# EAGLE design TriggerMount (EAGLE 9.6.2)
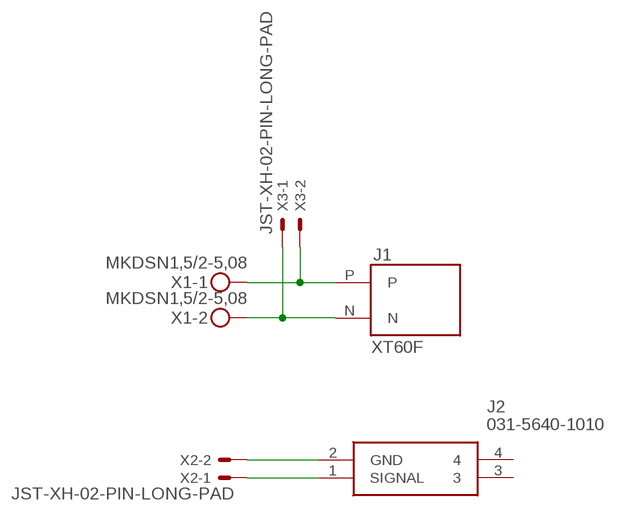
[diagram p0: schematic, sheet 1]

## Parts
J1  XT60F  [XT60PW]
J2  031-5640-1010  [03156401010]
X1  MKDSN1,5/2-5,08  [MKDSN1,5/2-5,08]
X2  JST-XH-02-PIN-LONG-PAD  [JST-XH-02-PACKAGE-LONG-PAD]
X3  JST-XH-02-PIN-LONG-PAD  [JST-XH-02-PACKAGE-LONG-PAD]

## Nets
N$1: J1.N X1.2 X3.1
N$2: J1.P X1.1 X3.2
N$3: J2.2(GND) X2.2
N$4: J2.1(SIGNAL) X2.1
Unconnected: J2.3 J2.4

## Library data of the parts
J1 = VDS-Connectors:XT60
J2 = SamacSys_Parts:031-5640-1010: RF Connectors / Coaxial Connectors PC BH RECEPT Source: Datasheet <https://www.amphenolrf.com/downloads/dl/file/id/3144/product/593/031_5640_1010_customer_drawing.pdf>; ALLIED_NUMBER: 70141899; ALLIED_PRICE-STOCK: https://www.alliedelec.com/amphenolrf-031-5640-1010/70141899/; DESCRIPTION: RF Connectors / Coaxial Connectors PC BH RECEPT; HEIGHT: 15.9mm; MANUFACTURER_NAME: Amphenol; MANUFACTURER_PART_NUMBER: 031-5640-1010; MOUSER_PART_NUMBER: 523-31-5640-1010; MOUSER_PRICE-STOCK: https://www.mouser.co.uk/ProductDetail/Amphenol-RF/031-5640-1010?qs=py4qCovljJ8AWoJP%2FInlhw%3D%3D
X1 = con-phoenix-508:MKDSN1,5/2-5,08: MKDSN 1,5/ 2-5,08 Printklemme Nennstrom: 13,5 A Nennspannung: 250 V Rastermaß: 5,08 mm Polzahl: 2 Anschlussart: Schraubanschluss Montage: Löten Anschlussrichtung Leiter/Platine: 0 ° Artikelnummer: 1729128 Source: http://eshop.phoenixcontact.com .. 1729128.pdf
X2 X3 = Rembrandt Electronics - JST XH Connectors v1-0:JST-XH-02-PIN: JST XH Connector 2 Pin Wire to board connector. Pitch: 2,54 mm, (0.100") Number of pins: 2 Created by Rembrandt Electronics www.rembrandtelectronics.com

## Board
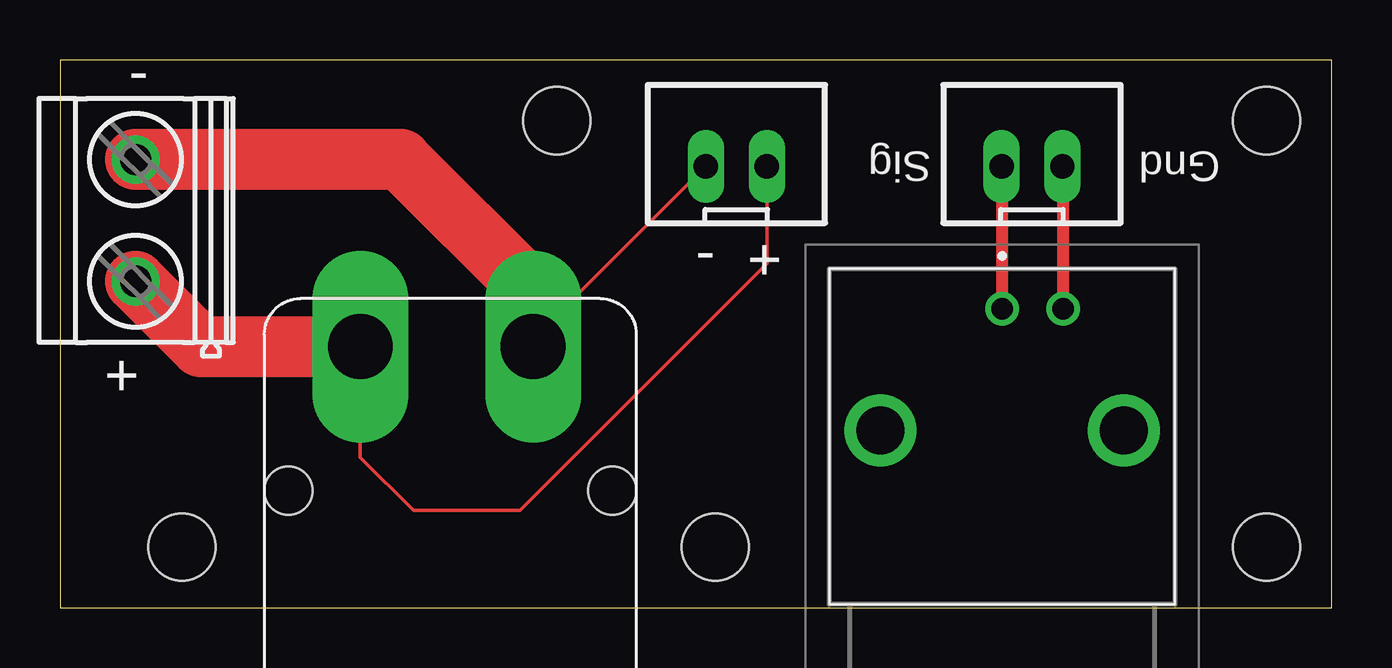
[diagram p1: board, top side]
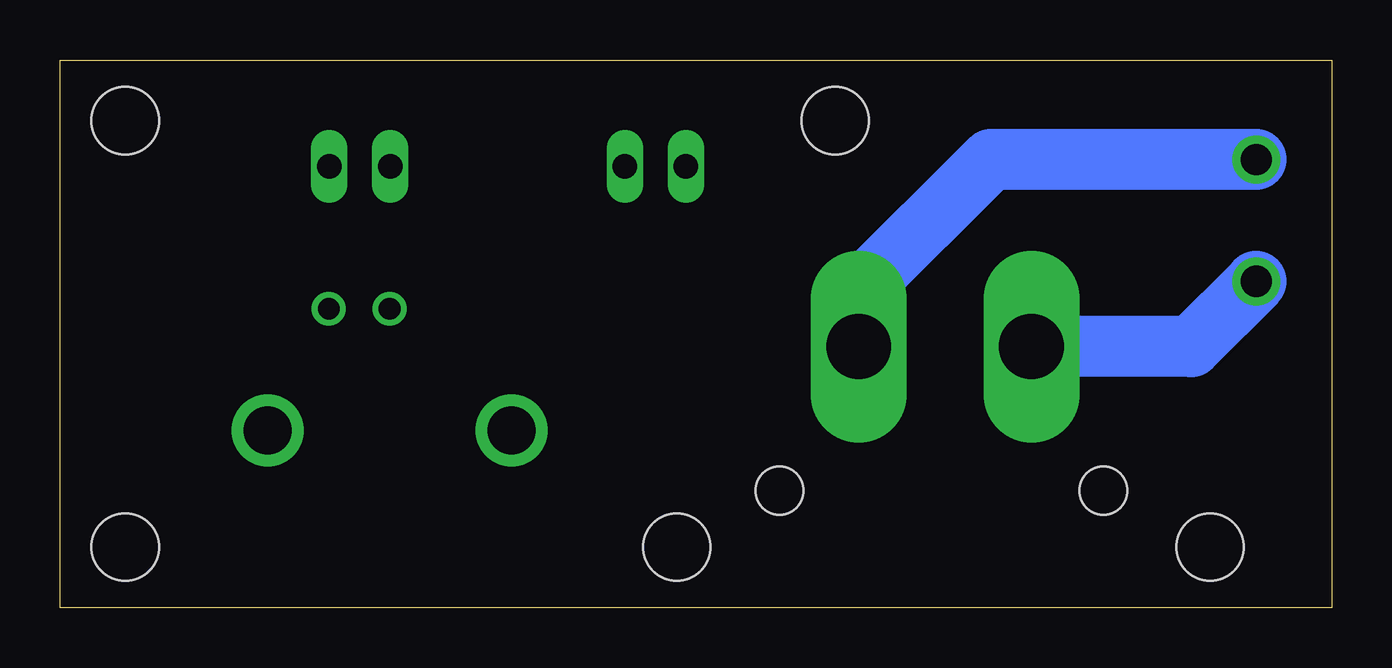
[diagram p2: board, bottom side, seen from below]

Size 53.01 x 22.85 mm. Coordinates in mm from the lower left corner, seen from the top.
Outline: 0,0 53.01,0 53.01,22.85 0,22.85 0,0
Copper layers (1*16): Top 0.035mm / dielectric 1.5mm / Bottom 0.035mm
Design rules "default": minimum track width 6mil, minimum drill 0.35mm, track to track 6mil, track to pad 6mil, pad to pad 6mil, via to via 6mil, smd to smd 6mil, copper to edge 40mil, drill to drill 6mil, minimum pad ring 10mil, minimum via ring 8mil, stop-mask expansion 4mil, vias tented up to drill 0mil, thermal gap 10mil
Holes 2.8 mm at 5.08,2.54 50.29,20.32 50.29,2.54 27.3,2.54 20.7,20.32

### Footprints (pad centres in the part's own frame; a part is rotated, then mirrored left to right if it is on the bottom)
XT60PW = drill 2.7 pad 4 long: N -5.9,3.45; P -5.9,-3.75 | hole 2: 0.1,-6.75; 0.1,6.75
03156401010 = drill 0.9 pad 1.4: 1 0,0; 2 -2.54,0 | drill 2 pad 3: 3 5.08,5.08; 4 -5.08,5.08
MKDSN1,5/2-5,08 = drill 1.3 pad 2: 1 -2.561,0.025; 2 2.519,0.025
JST-XH-02-PACKAGE-LONG-PAD = drill 1.016 long: 1 -1.27,0; 2 1.27,0

### Placement (x,y rotation side)
J1  16.27,5 270 top
J2  39.27,12.48 180 top
X1  3.17,16.18 90 top
X2  40.51,18.41 0 top
X3  28.19,18.41 0 top

### Tracks (layer width: path | path; a pad name or v marks a point on that pad's centre or on a via)
N$1
  Top 0.152: J1.N 19.72,11.21 X3.1
  Top 2.54: J1.N 19.72,13.19 14.21,18.7 X1.2
  Bottom 2.54: X1.2 14.21,18.7 19.72,13.19 J1.N
N$2
  Top 0.152: X3.2 29.46,14.35 19.18,4.06 14.73,4.06 12.52,6.28 J1.P
  Top 2.54: X1.1 5.87,10.9 J1.P
  Bottom 2.54: X1.1 5.87,10.9 J1.P
N$3
  Top 0.508: X2.2 41.81,18.39 J2.2
N$4
  Top 0.508: X2.1 39.27,18.39 J2.1

### Text on the board
tPlace: - | Sig | Gnd | - | + | +